# Altium schematic sheet Microcontroller.SchDoc
size A3; Organization: Rotronic AG; Address1: Grindelstrasse 6; Address2: 8303 Bassersdorf; Address3: Switzerland; DocumentNumber: 2; SheetNumber: 2; SheetTotal: 8; Web_Address: www.rotronic.ch; E_Mail_Address: *@rotronic.ch; Fon: +41 (0)44 838 11 11; Fax: +41 (0)44 836 44 24
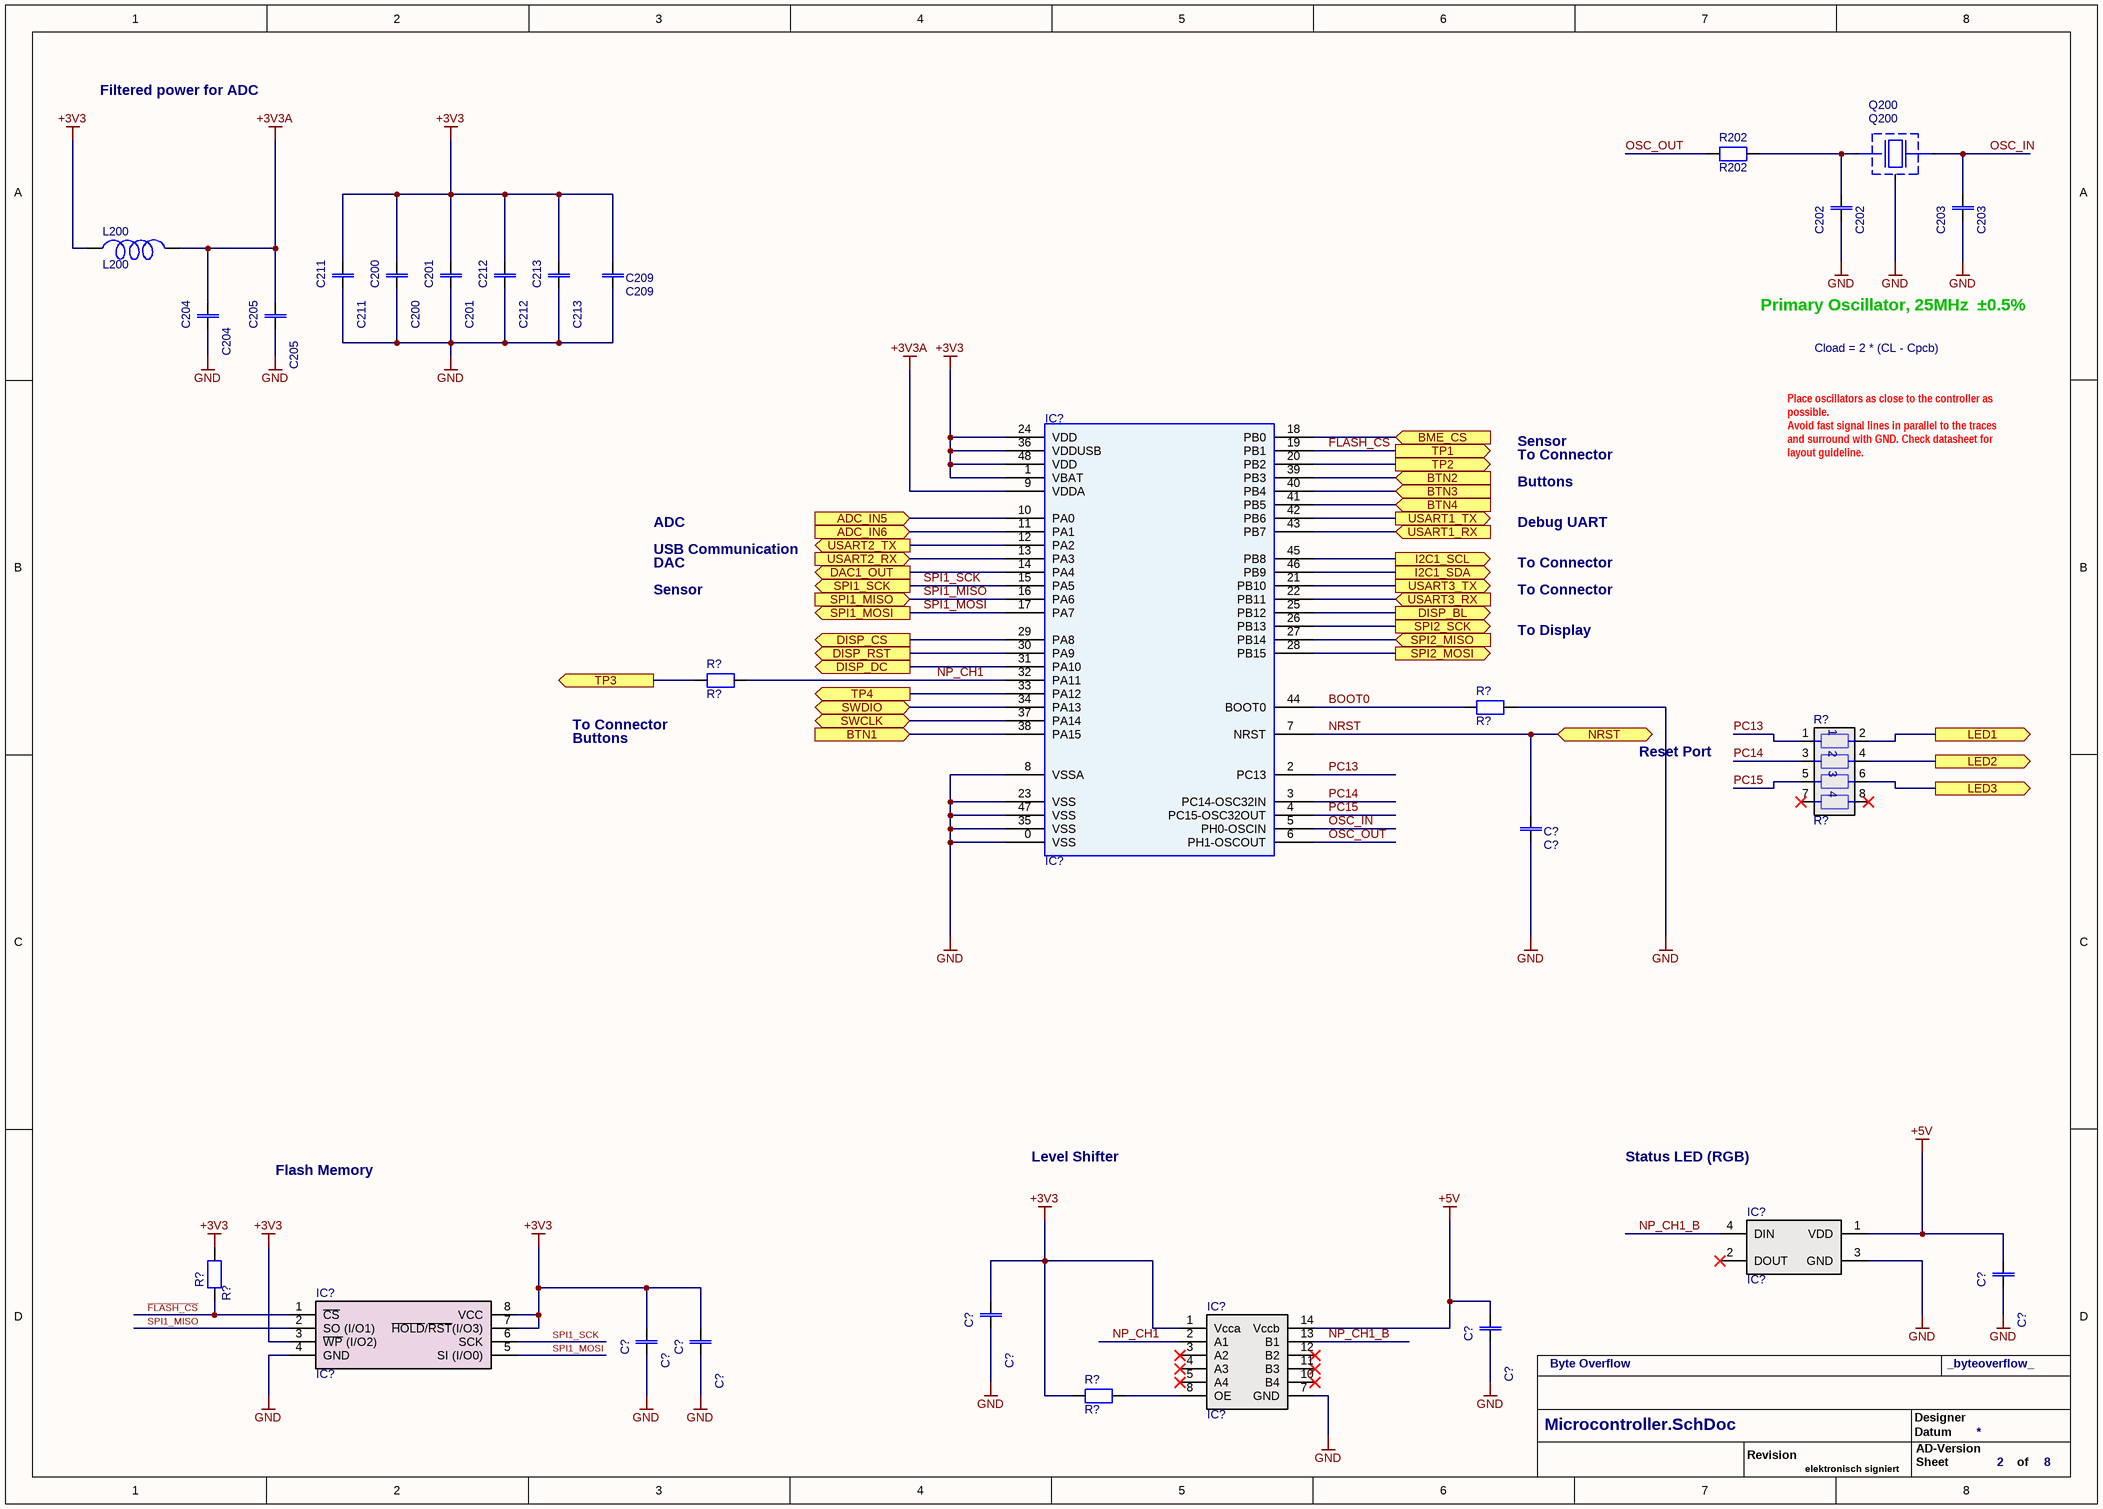
[diagram p0: Microcontroller.SchDoc]

## Parts
(Parts that share a designator on the sheet are numbered #1, #2 ... from top to bottom, then left to right.)
C200  C200  [0603-1608]
C201  C201  [0603-1608]
C202  C202  [0603-1608]
C203  C203  [0603-1608]
C204  C204  [0603-1608]
C205  C205  [0603-1608]
C209  C209  [0603-1608]
C211  C211  [0603-1608]
C212  C212  [0603-1608]
C213  C213  [0603-1608]
C?#1  C?  [0805-2012]
C?#2  C?  [0603-1608]
C?#3  C?  [0603-1608]
C?#4  C?  [0603-1608]
C?#5  C?  [0402-1005]
C?#6  C?  [0402-1005]
IC?#1  IC?  [QFN48 7x7x0.9 WIZnet]
IC?#2  IC?  [LED_2812]
IC?#3  IC?  [SOIC-8]
IC?#4  IC?  [TSSOP14]
L200  L200  [0603-1608]
Q200  Q200  [ABM8G]
R202  R202  [0603-1608]
R?#1  R?  [0603-1608]
R?#2  R?  [0603-1608]
R?#3  R?  [Array-2010-4Way]
R?#4  R?  [0402-1005]
R?#5  R?  [0805-2012]

## Ports
ADC_IN5 (in), ADC_IN6 (in), BME_CS (in), BTN1 (in), BTN2 (in), BTN3 (in), BTN4 (in), DAC1_OUT (out), DISP_BL (out), DISP_CS (out), DISP_DC (out), DISP_RST (out), I2C1_SCL (out), I2C1_SDA (out), LED1 (out), LED2 (out), LED3 (out), NRST (bidir), SPI1_MISO (in), SPI1_MOSI (out), SPI1_SCK (out), SPI2_MISO (in), SPI2_MOSI (out), SPI2_SCK (out), SWCLK (bidir), SWDIO (bidir), TP1 (out), TP2 (out), TP3 (out), TP4 (out), USART1_RX (in), USART1_TX (out), USART2_RX (in), USART2_TX (out), USART3_RX (in), USART3_TX (out)

## Nets
+3V3: C200.1 C201.1 C209.1 C211.1 C212.1 C213.1 C?#3.1 C?#5.1 C?#6.1 IC?#1.1(VBAT) IC?#1.24(VDD) IC?#1.36(VDDUSB) IC?#1.48(VDD) IC?#3.3(~{WP}_(I/O2)) IC?#3.7(~{HOLD}/~{RST}(I/O3)) IC?#3.8(VCC) IC?#4.1(Vcca) L200.1 R?#4.2 R?#5.1
+3V3A: C204.1 C205.1 IC?#1.9(VDDA) L200.2
+5V: C?#2.1 C?#4.1 IC?#2.1(VDD) IC?#4.14(Vccb)
GND: C200.2 C201.2 C202.2 C203.2 C204.2 C205.2 C209.2 C211.2 C212.2 C213.2 C?#1.2 C?#2.2 C?#3.2 C?#4.2 C?#5.2 C?#6.2 IC?#1.0(VSS) IC?#1.8(VSSA) IC?#1.23(VSS) IC?#1.35(VSS) IC?#1.47(VSS) IC?#2.3(GND) IC?#3.4(GND) IC?#4.7(GND) Q200.3(GND) R?#2.2
~{FLASH_CS}: IC?#1.19(PB1) IC?#3.1(~{CS}) R?#4.1 ; port TP1
ADC_IN5: IC?#1.10(PA0) ; port ADC_IN5
ADC_IN6: IC?#1.11(PA1) ; port ADC_IN6
BME_CS: IC?#1.18(PB0) ; port BME_CS
BOOT0: IC?#1.44(BOOT0) R?#2.1
BTN1: IC?#1.38(PA15) ; port BTN1
BTN2: IC?#1.39(PB3) ; port BTN2
BTN3: IC?#1.40(PB4) ; port BTN3
BTN4: IC?#1.41(PB5) ; port BTN4
DAC1_OUT: IC?#1.14(PA4) ; port DAC1_OUT
DISP_BL: IC?#1.25(PB12) ; port DISP_BL
DISP_CS: IC?#1.29(PA8) ; port DISP_CS
DISP_DC: IC?#1.31(PA10) ; port DISP_DC
DISP_RST: IC?#1.30(PA9) ; port DISP_RST
I2C1_SCL: IC?#1.45(PB8) ; port I2C1_SCL
I2C1_SDA: IC?#1.46(PB9) ; port I2C1_SDA
LED1: R?#3.2 ; port LED1
LED2: R?#3.4 ; port LED2
LED3: R?#3.6 ; port LED3
NP_CH1: IC?#1.32(PA11) IC?#4.2(A1) R?#1.2
NP_CH1_B: IC?#2.4(DIN) IC?#4.13(B1)
NRST: C?#1.1 IC?#1.7(NRST) ; port NRST
OSC_IN: C203.1 IC?#1.5(PH0-OSCIN) Q200.2
OSC_OUT: IC?#1.6(PH1-OSCOUT) R202.1
PC13: IC?#1.2(PC13) R?#3.1
PC14: IC?#1.3(PC14-OSC32IN) R?#3.3
PC15: IC?#1.4(PC15-OSC32OUT) R?#3.5
SPI1_MISO: IC?#1.16(PA6) IC?#3.2(SO_(I/O1)) ; port SPI1_MISO
SPI1_MOSI: IC?#1.17(PA7) IC?#3.5(SI_(I/O0)) ; port SPI1_MOSI
SPI1_SCK: IC?#1.15(PA5) IC?#3.6(SCK) ; port SPI1_SCK
SPI2_MISO: IC?#1.27(PB14) ; port SPI2_MISO
SPI2_MOSI: IC?#1.28(PB15) ; port SPI2_MOSI
SPI2_SCK: IC?#1.26(PB13) ; port SPI2_SCK
SWCLK: IC?#1.37(PA14) ; port SWCLK
SWDIO: IC?#1.34(PA13) ; port SWDIO
TP2: IC?#1.20(PB2) ; port TP2
TP3: R?#1.1 ; port TP3
TP4: IC?#1.33(PA12) ; port TP4
USART1_RX: IC?#1.43(PB7) ; port USART1_RX
USART1_TX: IC?#1.42(PB6) ; port USART1_TX
USART2_RX: IC?#1.13(PA3) ; port USART2_RX
USART2_TX: IC?#1.12(PA2) ; port USART2_TX
USART3_RX: IC?#1.22(PB11) ; port USART3_RX
USART3_TX: IC?#1.21(PB10) ; port USART3_TX
NetC202_1: C202.1 Q200.1 R202.2
NetIC?#4_8: IC?#4.8(OE) R?#5.2

Not connected (* = marked no-connect by the designer): IC?#2 2(DOUT)*; IC?#4 3(A2)* 4(A3)* 5(A4)* 6(NC) 9(NC) 10(B4)* 11(B3)* 12(B2)*; R?#3 7* 8*

## Notes on the sheet
- Filtered power for ADC
- Primary Oscillator, 25MHz  ±0.5%
- Cload = 2 * (CL - Cpcb)
- Sensor
- Buttons
- To Connector
- Place oscillators as close to the controller as possible.
  Avoid fast signal lines in parallel to the traces and surround with GND. Check datasheet for layout guideline.
- USB Communication
- ADC
- DAC
- Debug UART
- To Display
- Reset Port
- Flash Memory
- Level Shifter
- Status LED (RGB)
- Byte Overflow
- _byteoverflow_
- Revision
- Designer
- Datum
- AD-Version
- elektronisch signiert
- Sheet
- of

## Library data of the parts
C200 C201 C205 C211-C213 C?#2-C?#4 = F0161: Capacitor; Part-Number: 63.0104.1450; Manufacturer: KEMET; Manufacturer Part Number: C0603C104K5RACTU; Designator: C 100nF 50V X7R; ID: F0161; Operating Range: -55°C to +125°C; Note: 100nF 50V X7R 10% Kemet C0603C104K5RACTU; Specification: 05.09.2013 OPT; Value: 100nF 50V; Component Type: Standard; ComponentLink1Description: Datasheet; ComponentLink1URL: http://www.kemet.com/kemet/web/homepage/kechome.nsf/vapubfiles/KEM_C1002_X7R_SMD.pdf/$file/KEM_C1002_X7R_SMD.pdf; Status: Active; Availability Date: 15.11.2016 OPT; RoHS compliant: Yes; Flammability: n.a.; Pin Count: 2; Price 100: 0.007; Price 1000: 0.007; Price Date: 02.12.2019 Pro Alpha; Changed: 05.09.2013 OPT; Price: 0.01; Supplier 1: Digi-Key; Supplier Part Number 1: 399-5089-1-ND; Part Status: Active; RoHS: RoHS Compliant
C202 C203 = F0038: Capacitor; Part-Number: 63.0120.0400; Manufacturer: KEMET; Manufacturer Part Number: C0603C120K1GACTU; Designator: C 12pF 100V; ID: F0038; Operating Range: -55°C to +125°C; Note: 12pF NP0 100V 10% AVX 06031A120KAT2A; Specification: 19.09.2011 MLP; Verification: 05.07.2012 OPT; Value: 12pF 100V; Component Type: Standard; ComponentLink1Description: http://www.kemet.com/docfinder?Partnumber=C0603C120K1GACTU; ComponentLink1URL: http://www.kemet.com/docfinder?Partnumber=C0603C120K1GACTU; Status: Active; Availability Date: 15.11.2016 OPT; RoHS compliant: Yes; Flammability: n.a.; Pin Count: 2; Price 100: 0.011; Price 1000: 0.011; Price Date: 02.12.2019 Pro Alpha; Changed: 19.09.2011 MLP; Price: 0.011; Supplier 1: Digi-Key; Supplier Part Number 1: 399-8995-1-ND; Part Status: Active; RoHS: RoHS Compliant
C204 = F0180: Capacitor; Part-Number: 63.7000.0123; Manufacturer: KEMET; Manufacturer Part Number: C0603C105K3RACTU; Designator: C 1uF 25V; ID: F0180; Operating Range: -55°C to +125°C; Note: 1uF 10% 25V X7R Kemet C0603C105K3RACTU; Specification: 18.09.2014 OPT; Changed: 23.09.2014 OPT; Value: 1uF 25V; Component Type: Standard; ComponentLink1Description: Datasheet; ComponentLink1URL: http://www.yuden.co.jp/eu/product/category/capacitor/TMK107B7105KA-T.html; Status: Active; Availability Date: 15.11.2016 OPT; RoHS compliant: Yes; Flammability: n.a.; Pin Count: 2; Price 100: 0.022; Price 1000: 0.018; Price Date: 02.12.2019 Pro Alpha; Price: 0.014; Supplier 1: Digi-Key; Supplier Part Number 1: 399-7376-1-ND; Part Status: Active; RoHS: RoHS Compliant
C209 = F0193: Capacitor; Part-Number: 63.7000.0032; Manufacturer: Murata Electronics North America; Manufacturer Part Number: GRM188R61E475ME11D; Designator: C 4.7uF 25V; ID: F0193; Operating Range: -55°C to +85°C; Note: 4.7uF 25V X5R 20% Murata Electronics GRM188R61E475ME11D; Specification: 02.09.2015 OPT; Value: 4.7uF 25V X5R; Component Type: Standard; ComponentLink1Description: Datasheet; ComponentLink1URL: http://search.murata.co.jp/Ceramy/image/img/A01X/partnumbering_e_01.pdf; Status: Active; Availability Date: 15.11.2016 OPT; RoHS compliant: Yes; Flammability: n.a.; ComponentLink2Description: http://search.murata.co.jp/Ceramy/image/img/A01X/G101/ENG/GRM188R61E475ME11-01.pdf; ComponentLink2URL: http://search.murata.co.jp/Ceramy/image/img/A01X/G101/ENG/GRM188R61E475ME11-01.pdf; Pin Count: 2; Price 100: 0.13; Price 1000: 0.11; Price Date: 02.12.2019 Pro Alpha; Changed: 02.09.2015 OPT; Price: 0.096; Supplier 1: Digi-Key; Supplier Part Number 1: GRM188R61E475ME11D-ND; Part Status: Active; RoHS: RoHS Compliant
C?#1 = F0123: Capacitor; Part-Number: 63.0104.1500; Manufacturer: KEMET; Manufacturer Part Number: C0805C104M5RACTU; ID: F0123; Operating Range: -40°C to +85°C; Note: 100nF 50V X7R 20% AVX 08055C104MAT2A; Specification: 21.12.2012 OPT; Value: 100nF 50V; Designator: C 100nF 50V; Component Type: Standard; ComponentLink1Description: Datasheet; ComponentLink1URL: http://avx.com/docs/Catalogs/cx7r.pdf; Status: Active; Availability Date: 15.11.2016 OPT; RoHS compliant: Yes; Flammability: n.a.; Pin Count: 2; Price 100: 0.014; Price 1000: 0.014; Price Date: 02.12.2019 Pro Alpha; Changed: 21.12.2012 OPT; Price: 0.026; Supplier 1: Digi-Key; Supplier Part Number 1: 399-1169-1-ND; Part Status: Active; RoHS: RoHS Compliant; ComponentLink2Description: http://www.kemet.com/docfinder?Partnumber=C0805C104M5RACTU; ComponentLink2URL: http://www.kemet.com/docfinder?Partnumber=C0805C104M5RACTU
C?#5 = F0091: Capacitor; Part-Number: 63.7000.0020; Manufacturer: KEMET; Manufacturer Part Number: C0402C105K9PACTU; ID: F0091; Operating Range: -55°C to +125°C; Note: 1uF X5R 6.3V 10% Taiyo Yuden JMK105BJ105KV-F; Specification: 19.09.2011 MLP; Verification: 05.07.2012 OPT; Value: 1uF 6.3V; Designator: C 1uF 6.3V; Component Type: Standard; Pin Count: 2; Price 100: 0.004; Price 1000: 0.004; Price Date: 01.06.2021 Pro Alpha; Changed: 19.09.2011 MLP; Price: 0.005; Availability Date: 15.11.2016 OPT; Flammability: n.a.; RoHS compliant: Yes; Status: Active; ComponentLink1Description: http://www.kemet.com/docfinder?Partnumber=C0402C105K9PACTU; ComponentLink1URL: http://www.kemet.com/docfinder?Partnumber=C0402C105K9PACTU; Part Status: Active; RoHS: RoHS Compliant; Supplier Part Number 1: 399-4873-1-ND; Supplier: Digi-Key
C?#6 = F0216: Capacitor; Part-Number: 63.0104.1505; Manufacturer: Murata Electronics North America; Manufacturer Part Number: GCM155R71H104KE02D; ID: F0216; Operating Range: -55°C to +125°C; Note: 100nF 50V X7R 10% Murata GCM155R71H104KE02D; Specification: 22.07.2016 OPT; Value: 100nF 50V; Designator: C 100nF 50V X7R; Component Type: Standard; ComponentLink1Description: Datasheet; ComponentLink1URL: http://www.murata.com/~/media/webrenewal/support/library/catalog/products/capacitor/mlcc/c02e.pdf; Pin Count: 2; Price 100: 0.007; Price 1000: 0.004; Price Date: 01.06.2021 Pro Alpha; Changed: 22.07.2016 OPT; Price: 0.013; Availability Date: 15.11.2016 OPT; Flammability: n.a.; RoHS compliant: Yes; Status: Active; Part Status: Active; RoHS: RoHS Compliant; Supplier Part Number 1: 490-10700-1-ND; Supplier: Digi-Key
IC?#1 = H0056: uC; Part-Number: 00.0000.0000; Manufacturer: STMicroelectronics; Designator: ST STM32L452CEU6; ID: H0056; Operating Range: -40°C to +85°C; Note: ARM Mikrocontroller - MCU STM32 Dyn Eff MCU 512 K 100 MHz CPU; Changed: 19.10.2022 PEK; Value: ST STM32L452CEU6; Component Type: Standard; ComponentLink1Description: Datasheet; ComponentLink1URL: https://www.st.com/resource/en/datasheet/stm32l452re.pdf; Status: Active; Availability Date: 19.10.2022 PEK; RoHS compliant: Yes; Flammability: n.a; Pin Count: 48; Price 100: 9.99; Price 1000: 9.99; Price Date: 19.10.2022 PEK; Specification: 19.10.2022 PEK; Price: 11.81; Supplier 1: Farnell; Manufacturer Part Number: STM32L452CEU6; Part Status: Active; RoHS: RoHS Compliant
IC?#2 = A0133: LED; Part-Number: 00.0000.0000; Manufacturer: China; ID: A0133; Operating Range: -40°C to +85°C; Note: Addressable RGB LED; Value: WS2812B; Specification: 14.11.2019 PEK; Designator: WS2812B; Component Type: Standard; ComponentLink1Description: Datasheet; ComponentLink1URL: https://cdn-shop.adafruit.com/datasheets/WS2812B.pdf; Status: Active; Availability Date: 14.11.2019 PEK; RoHS compliant: Yes; Flammability: n.a.; Pin Count: 4; Price 100: 0.4; Price 1000: 0.4; Verification: 14.11.2019 PEK; Changed: 14.11.2019 PEK; Price: 0.4; Price Date: 14.11.2019 PEK; Supplier: Aliexpress; Supplier Part Number: WS2812B; Manufacturer Part Number: WS2812B; Part Status: Active; RoHS: RoHS Compliant
IC?#3 = L0028: Memory; Part-Number: 61.2541.2016; Designator: AT25XE041D-SSHN; ID: L0028; Operating Range: -40°C to +85°C; Note: Adesto Technologies AT25XE041D-SSHN Flash-Speicher 4Mb 1.65V 133Mhz SPI Serial Flash; Changed: 21.06.2021 FUW; Specification: 12.02.2021 ENP; Value: AT25XE041D-SSHN; Component Type: Standard; ComponentLink1Description: Datasheet; ComponentLink1URL: https://www.dialog-semiconductor.com/sites/default/files/ds-at25xe041d.pdf; Status: Active; Availability Date: 12.02.2021 ENP; RoHS compliant: Yes; Flammability: n.a.; Pin Count: 8; Price 100: 0.379; Price 1000: 0.339; Price Date: 12.02.2021 ENP; Price: 0.467
IC?#4 = E0093: Level-shifter; Part-Number: 61.0104.9900; Manufacturer: Texas Instruments; ID: E0093; Operating Range: -40°C to +85°C; Note: Ti TXB0104PWR 4-Bit Bidirectional Voltage-level Translator With Automatic Direction Sensing; Specification: 06.08.2015 NEC; Value: TXB0104PWR; Designator: TXB0104; Component Type: Standard; ComponentLink1Description: Datasheet; ComponentLink1URL: http://www.ti.com/lit/ds/symlink/txb0104.pdf; Status: Active; Availability Date: 15.11.2016 OPT; RoHS compliant: Yes; Flammability: n.a.; Pin Count: 14; Price 100: 0.95; Price 1000: 0.55; Price Date: 02.12.2019 Pro Alpha; Changed: 06.08.2015 NEC; Price: 0.883; Supplier 1: Digi-Key; Supplier Part Number 1: 296-21929-1-ND; Manufacturer Part Number: TXB0104PWR; Part Status: Active; RoHS: RoHS Compliant
L200 = M0007: Inductor; Part-Number: 69.0220.0000; Manufacturer: Taiyo Yuden; Manufacturer Part Number: HK160822NJ-T; Designator: L 22nH; ID: M0007; Operating Range: -40°C to +85°C; Note: Taiyo Yuden HK160822NJ-T Festinduktoren INDCTR HIFREQ MLTLYR 0603 22nH 5%; Specification: 19.09.2011 MLP; Verification: 05.07.2012 OPT; Value: 22nH; Component Type: Standard; Status: Active; Availability Date: 15.11.2016 OPT; RoHS compliant: Yes; Flammability: n.a.; Pin Count: 2; Price 100: 0.076; Price 1000: 0.05; Price Date: 02.12.2019 Pro Alpha; Changed: 19.09.2011 MLP; Price: 0.029; Supplier 1: Digi-Key; Supplier Part Number 1: 587-1549-1-ND; Part Status: Active; RoHS: RoHS Compliant
Q200 = J0008: Resonator; Part-Number: 77.2500.1800; Manufacturer: Abracon LLC; Manufacturer Part Number: ABM8G-25.000MHZ-18-D2Y-T; Designator: Quarz 25MHz 18pF 30ppm; ID: J0008; Operating Range: -40°C to +85°C; Note: ABRACON ABM8G-25.000MHZ-18-D2Y-T Quarze 25.000MHz 18pF 30ppm -40C +85C; Changed: 23.09.2014 OPT; Specification: 30.12.2013 OPT; Value: 25MHz 30ppm; Component Type: Standard; ComponentLink1Description: Datasheet; ComponentLink1URL: http://www.abracon.com/Resonators/ABM8G.pdf; Status: Active; Availability Date: 14.11.2016 OPT; RoHS compliant: Yes; Flammability: n.a.; Pin Count: 4; Price 100: 0.783; Price 1000: 0.548; Price Date: 02.12.2019 Pro Alpha; Price: 0.61; Supplier 1: Digi-Key; Supplier Part Number 1: 535-10275-1-ND; Part Status: Active; RoHS: RoHS Compliant
R202 = Q0402: Resistor; Part-Number: 71.2209.1400; Manufacturer: Vishay Beyschlag; Manufacturer Part Number: MCT06030C2209FP500; Designator: R 22E 1%; ID: Q0402; Operating Range: -55°C to +125°C; Note: 22E 1% 50ppm 1/10W Vishay MCT06030C2209FP500; Changed: 23.06.2017 NEC; Value: 22E 1%; Component Type: Standard; ComponentLink1Description: Datasheet; ComponentLink1URL: https://www.vishay.com/docs/28705/mcx0x0xpro.pdf; Status: Active; Availability Date: 23.06.2017 ENP; RoHS compliant: Yes; Flammability: n.a.; Pin Count: 2; Price 100: 0.059; Price 1000: 0.035; Price Date: 02.12.2019 Pro Alpha; Specification: 23.06.2017 NEC; Price: 0.029; Supplier: Digi-Key; Supplier Part Number: MCT0603-22.0-CFCT-ND; Part Status: Active; RoHS: RoHS Compliant
R?#1 = Q0011: Resistor; Part-Number: 71.1000.1300; Manufacturer: Vishay Dale; Manufacturer Part Number: CRCW0603100RFKEA; Designator: R 100E 1%; ID: Q0011; Operating Range: -55°C to +155°C; Note: 100E 1% 100ppm 1/10W Vishay / Dale CRCW0603100RFKTB; Changed: 19.09.2011 MLP; Verification: 05.07.2012 OPT; Value: 100E 1%; Component Type: Standard; ComponentLink1Description: http://www.vishay.com/docs/20035/dcrcwe3.pdf; ComponentLink1URL: http://www.vishay.com/docs/20035/dcrcwe3.pdf; Status: Active; Availability Date: 16.11.2016 OPT; RoHS compliant: Yes; Flammability: n.a.; Pin Count: 2; Price 100: 0.002; Price 1000: 0.002; Price Date: 02.12.2019 Pro Alpha; Specification: 19.09.2011 MLP; Price: 0.002; Supplier: Digi-Key; Supplier Part Number: 541-100HCT-ND; Part Status: Active; RoHS: RoHS Compliant
R?#2 = Q0017: Resistor; Part-Number: 71.1002.1300; Manufacturer: Vishay Dale; Manufacturer Part Number: CRCW060310K0FKEAHP; Designator: R 10k 1%; ID: Q0017; Operating Range: -55°C to +155°C; Note: 10k 1% 100ppm 1/10W Vishay CRCW060310K0FKEA; Changed: 19.09.2011 MLP; Verification: 05.07.2012 OPT; Value: 10k; Component Type: Standard; ComponentLink1Description: http://www.vishay.com/docs/20043/crcwhpe3.pdf; ComponentLink1URL: http://www.vishay.com/docs/20043/crcwhpe3.pdf; Status: Active; Availability Date: 16.11.2016 OPT; RoHS compliant: Yes; Flammability: n.a.; Pin Count: 2; Price 100: 0.002; Price 1000: 0.002; Price Date: 02.12.2019 Pro Alpha; Specification: 19.09.2011 MLP; Price: 0.001; Supplier: Digi-Key; Supplier Part Number: 541-10.0KSCT-ND; Part Status: Active; RoHS: RoHS Compliant
R?#3 = Q0303: Resistor; Part-Number: 71.1000.1399; Manufacturer: Vishay Dale; Manufacturer Part Number: CRA04S083100RJTD; Designator: R 100E 4x 5.0%; ID: Q0303; Operating Range: -55°C to +150°C; Note: 100E 4x 5.0% 200ppm 1/16W Vishay CRA04S083100RJTD; Changed: 23.09.2014 OPT; Specification: 30.06.2014 OPT; Value: 100E 4x 5.0%; Component Type: Standard; ComponentLink1Description: Datasheet; ComponentLink1URL: http://www.mouser.com/ds/2/427/cra04s-103900.pdf; Status: Active; Availability Date: 16.11.2016 OPT; RoHS compliant: Yes; Flammability: n.a.; ComponentLink2Description: http://www.vishay.com/docs/31043/cra04s.pdf; ComponentLink2URL: http://www.vishay.com/docs/31043/cra04s.pdf; Pin Count: 2; Price 100: 0.077; Price 1000: 0.058; Price Date: 01.06.2021 Pro Alpha; Price: 0.008; Supplier: Digi-Key; Supplier Part Number: CRA4S8100CT-ND; Part Status: Active; RoHS: RoHS Compliant
R?#4 = Q0018: Resistor; Part-Number: 71.1002.1400; Manufacturer: Vishay Dale; Manufacturer Part Number: CRCW040210K0FKEE; ID: Q0018; Note: 10k 1% 100ppm 1/16W Vishay / Dale CRCW040210K0FKTD; Changed: 19.09.2011 MLP; Verification: 05.07.2012 OPT; Value: 10k 1%; Operating Range: -55°C to +155°C; Designator: R 10k 1%; Component Type: Standart; Pin Count: 2; Price Date: 01.06.2021 Pro Alpha; Specification: 19.09.2011 MLP; Price: 0.012; Price 100: 0.002; Price 1000: 0.002; Availability Date: 16.11.2016 OPT; Flammability: n.a.; RoHS compliant: Yes; Status: Active; Part Status: Active; RoHS: RoHS Compliant; Supplier: Digi-Key; Supplier Part Number: 541-2954-1-ND
R?#5 = Q0244: Resistor; Part-Number: 71.0000.0500; Manufacturer: Vishay Dale; Manufacturer Part Number: CRCW08050000Z0EAHP; Designator: R 0E 1%; ID: Q0244; Operating Range: -55°C to +155°C; Note: 0E 1.0% Vishay/Dale CRCW08050000Z0EA; Changed: 23.04.2013 OPT; Verification: 05.03.2013 ENP; Value: 0E 1%; Component Type: Standard; ComponentLink1Description: Datasheet; ComponentLink1URL: http://www.mouser.com/ds/2/427/dcrcwe3-109170.pdf; Status: Active; Availability Date: 16.11.2016 OPT; RoHS compliant: Yes; Flammability: n.a.; ComponentLink2Description: http://www.vishay.com/docs/20043/crcwhpe3.pdf; ComponentLink2URL: http://www.vishay.com/docs/20043/crcwhpe3.pdf; Pin Count: 2; Price 100: 0.007; Price 1000: 0.007; Price Date: 02.12.2019 Pro Alpha; Specification: 23.04.2013 OPT; Price: 0.005; Supplier: Digi-Key; Supplier Part Number: 541-0.0TBCT-ND; Part Status: Active; RoHS: RoHS Compliant